# EAGLE design basler-trigger-shield (EAGLE 8.7.0)
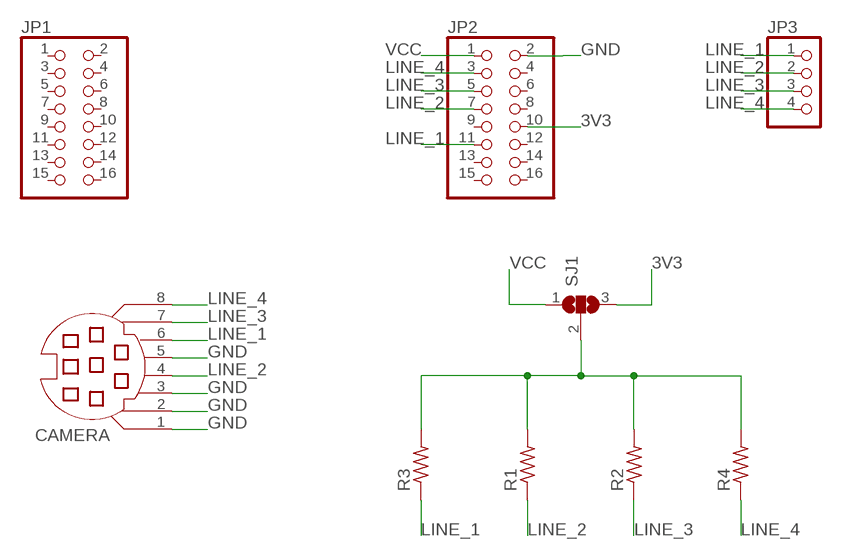
[diagram p0: schematic, sheet 1]

## Parts
CAMERA  MD08SS  [MDIN08SS]
JP1  PINHD-2X8  [2X08]
JP2  PINHD-2X8  [2X08]
JP3  PINHD-1X4  [1X04]
R1  R-US_R0603  [R0603]
R2  R-US_R0603  [R0603]
R3  R-US_R0603  [R0603]
R4  R-US_R0603  [R0603]
SJ1  SJ2W  [SJ_2]

## Nets
3V3: JP2.10 SJ1.3
GND: CAMERA.1 CAMERA.2 CAMERA.3 CAMERA.5 JP2.2
LINE_1: CAMERA.6 JP2.11 JP3.1 R3.1
LINE_2: CAMERA.4 JP2.7 JP3.2 R1.1
LINE_3: CAMERA.7 JP2.5 JP3.3 R2.1
LINE_4: CAMERA.8 JP2.3 JP3.4 R4.1
N$3: R1.2 R2.2 R3.2 R4.2 SJ1.2
VCC: JP2.1 SJ1.1
Unconnected: JP1.1 JP1.2 JP1.3 JP1.4 JP1.5 JP1.6 JP1.7 JP1.8 JP1.9 JP1.10 JP1.11 JP1.12 JP1.13 JP1.14 JP1.15 JP1.16 JP2.4 JP2.6 JP2.8 JP2.9 JP2.12 JP2.13 JP2.14 JP2.15 JP2.16

## Library data of the parts
CAMERA = con-yamaichi:MD08SS: YAMAICHI CONNECTOR; OC_FARNELL: unknown; OC_NEWARK: unknown
JP1 JP2 = pinhead:PINHD-2X8: PIN HEADER
JP3 = pinhead:PINHD-1X4: PIN HEADER
R1-R4 = rcl:R-US_: RESISTOR, American symbol; SPICEPREFIX: R
SJ1 = jumper:SJ2W: SMD solder JUMPER

## Board
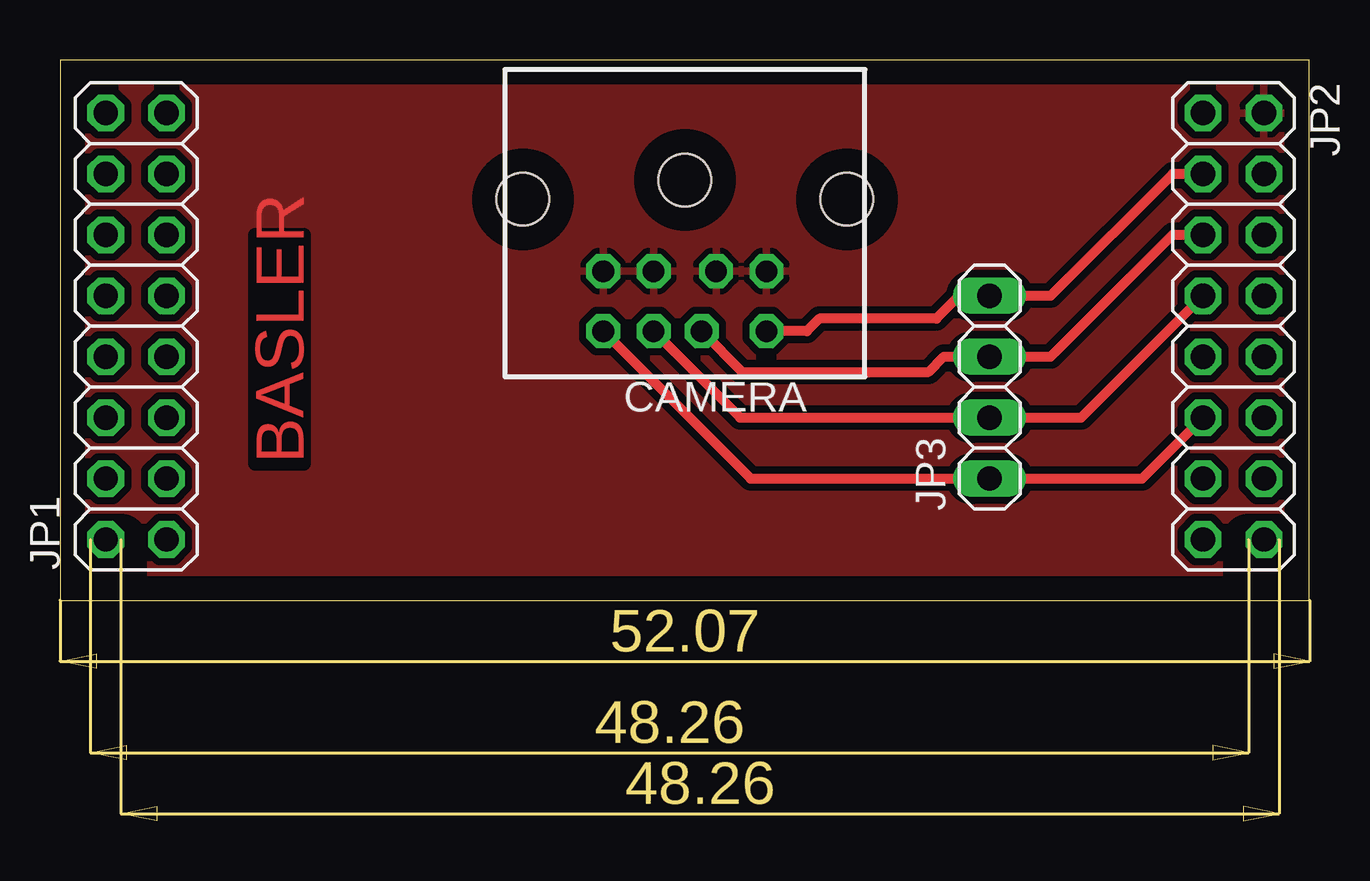
[diagram p1: board, top side]
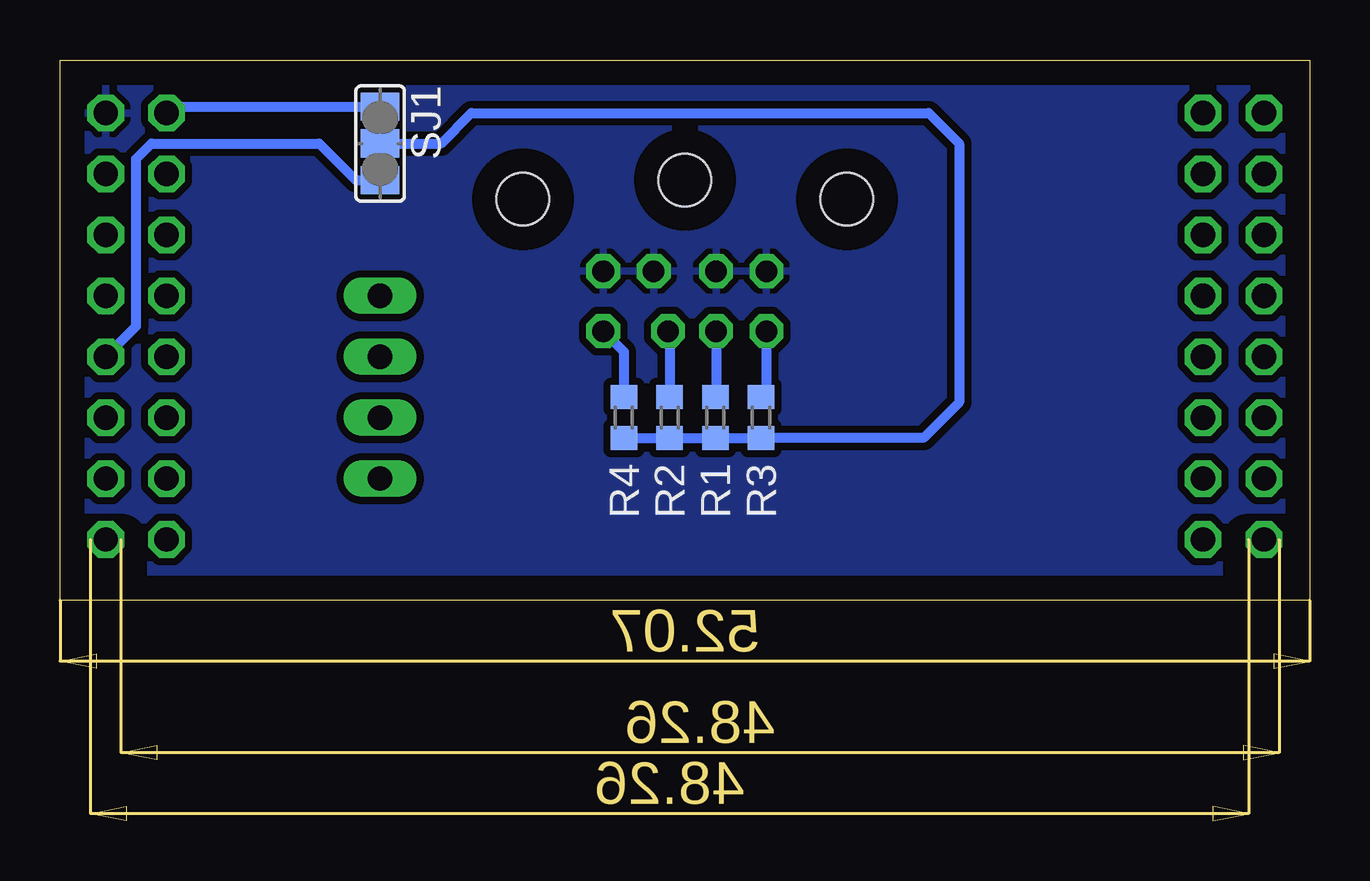
[diagram p2: board, bottom side, seen from below]

Size 52.05 x 22.53 mm. Coordinates in mm from the lower left corner, seen from the top.
Outline: 0,0 52.05,0 52.05,22.53 0,22.53 0,0
Copper layers (1*16): Top 0.035mm / dielectric 1.5mm / Bottom 0.035mm
Design rules "default": minimum track width 6mil, minimum drill 0.35mm, track to track 6mil, track to pad 6mil, pad to pad 6mil, via to via 6mil, smd to smd 6mil, copper to edge 40mil, drill to drill 6mil, minimum pad ring 10mil, minimum via ring 8mil, stop-mask expansion 4mil, vias tented up to drill 0mil, thermal gap 10mil

### Footprints (pad centres in the part's own frame; a part is rotated, then mirrored left to right if it is on the bottom)
MDIN08SS = drill 0.9 octagon: 1 1.3,8.5; 2 -1.3,8.5; 3 3.4,8.5; 4 1.3,11; 5 -3.4,8.5; 6 3.4,11; 7 -0.7,11; 8 -3.4,11 | hole 2.2: -6.75,5.5; 0,4.7; 6.75,5.5
2X08 = drill 1.016 octagon: 1 -8.89,-1.27; 2 -8.89,1.27; 3 -6.35,-1.27; 4 -6.35,1.27; 5 -3.81,-1.27; 6 -3.81,1.27; 7 -1.27,-1.27; 8 -1.27,1.27; 9 1.27,-1.27; 10 1.27,1.27; 11 3.81,-1.27; 12 3.81,1.27; 13 6.35,-1.27; 14 6.35,1.27; 15 8.89,-1.27; 16 8.89,1.27
1X04 = drill 1.016 long: 1 -3.81,0; 2 -1.27,0; 3 1.27,0; 4 3.81,0
R0603 = smd 1 x 1.1: 1 -0.85,0; 2 0.85,0
SJ_2 = smd 1.168 x 1.6: 1 -1.524,0; 2 0,0; 3 1.524,0

### Placement (x,y rotation side)
CAMERA  26.04,22.23 180 top
JP1  3.17,11.43 90 top
JP2  48.9,11.43 270 top
JP3  38.73,8.89 90 top
R1  24.77,7.62 270 bottom
R2  26.67,7.62 270 bottom
R3  22.86,7.62 270 bottom
R4  28.57,7.62 270 bottom
SJ1  38.73,19.05 270 bottom

### Tracks (layer width: path | path; a pad name or v marks a point on that pad's centre or on a via)
3V3
  Bottom 0.406: JP2.10 48.9,11.43 48.9,18.41 48.26,19.05 41.27,19.05 39.75,17.53 SJ1.3
GND
  pour Top (isolate 0.305): 0,22.86 52.07,22.86 52.07,-0.64 0,-0.64
  pour Bottom (isolate 0.305): -0.64,23.5 52.7,23.5 52.7,-0.64 52.07,-1.27 -0.64,-1.27
LINE_1
  Top 0.406: CAMERA.6 28.78,5.08 JP3.1 45.09,5.08 JP2.11
  Bottom 0.406: CAMERA.6 22.64,8.7 R3.1
LINE_2
  Top 0.406: CAMERA.4 28.34,7.62 JP3.2 42.55,7.62 JP2.7
  Bottom 0.406: CAMERA.4 24.73,8.5 R1.1
LINE_3
  Top 0.406: CAMERA.7 28.43,9.53 36.2,9.53 36.83,10.16 JP3.3 41.27,10.16 46.35,15.24 JP2.5
  Bottom 0.406: CAMERA.7 26.67,11.16 R2.1
LINE_4
  Top 0.406: CAMERA.8 31.11,11.22 31.64,11.75 36.51,11.75 37.47,12.7 JP3.4 41.27,12.7 46.35,17.78 JP2.3
  Bottom 0.406: CAMERA.8 28.57,10.37 R4.1
N$3
  Bottom 0.406: R4.2 R2.2 R1.2 R3.2 16.09,6.77 14.61,8.26 14.61,19.05 15.88,20.32 34.92,20.32 36.2,19.05 SJ1.2
VCC
  Bottom 0.406: JP2.1 47.37,20.57 SJ1.1

### Text on the board
Top: BASLER